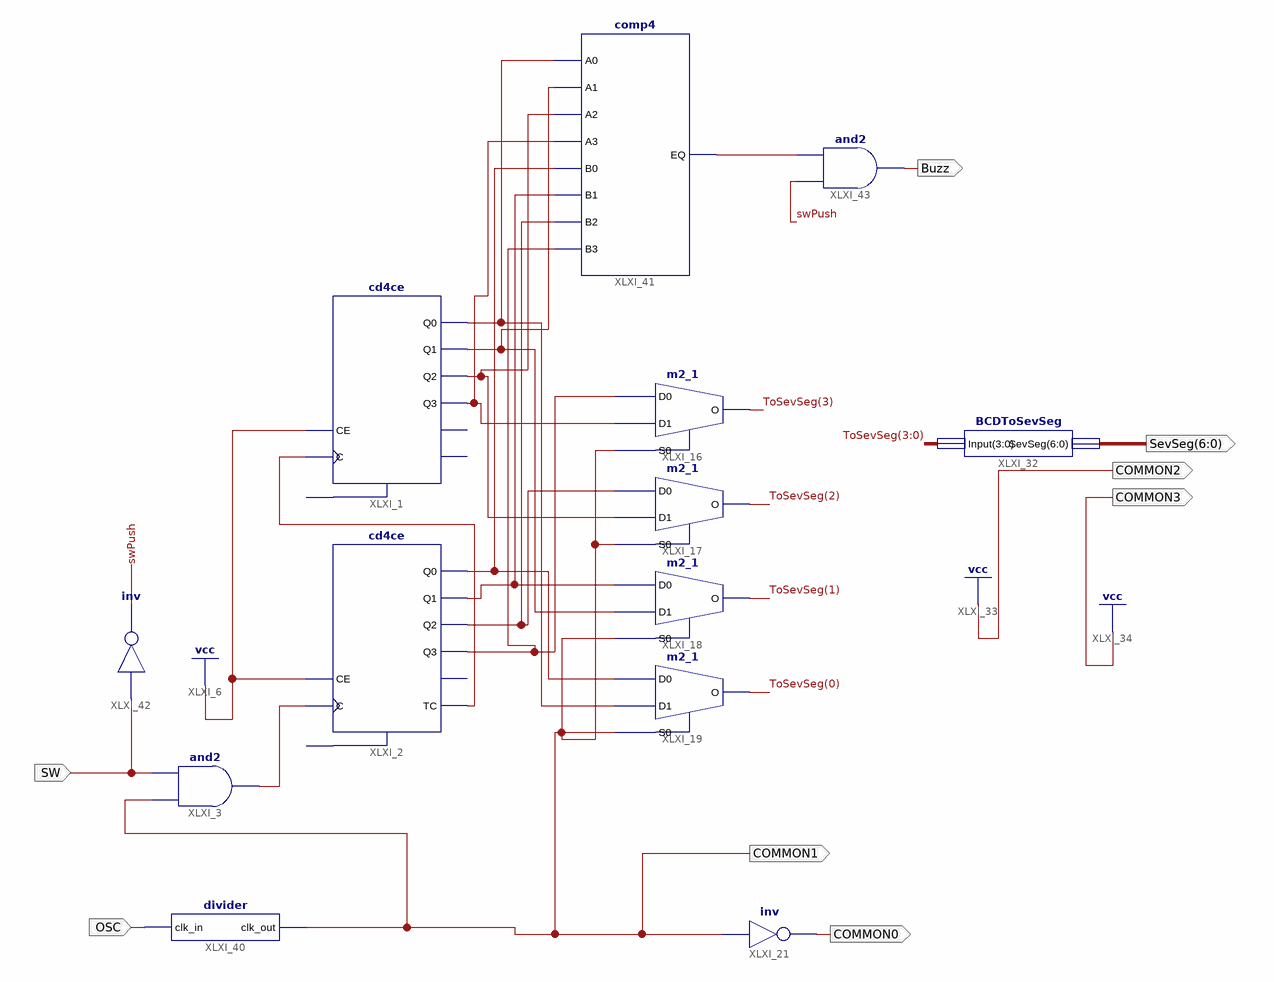
[diagram p0: schematic sheet 1]
// Xilinx ISE schematic CounterNaja.sch (spartan6) as structural Verilog: 13 symbols, 8 ports
module CounterNaja (
  input  SW,
  input  OSC,
  output COMMON0,
  output COMMON2,
  output COMMON3,
  output [6:0] SevSeg,
  output COMMON1,
  output Buzz
);

  wire Buzzer, L7, OutA_0, OutA_1, OutA_2, OutA_3, OutB_0, OutB_1, OutB_2, swPush, XLXN_16, XLXN_76;
  wire [3:0] ToSevSeg;

  cd4ce XLXI_1 (.C(XLXN_16), .CE(1'b1), .Q0(OutB_0), .Q1(OutB_1), .Q2(OutB_2), .Q3(L7));  // open: CLR, CEO, TC
  cd4ce XLXI_2 (
    .C(XLXN_76), .CE(1'b1), .Q0(OutA_0), .Q1(OutA_1), .Q2(OutA_2), .Q3(OutA_3), .TC(XLXN_16));  // open: CLR, CEO
  and XLXI_3 (XLXN_76, COMMON1, SW);
  m2_1 XLXI_16 (.D0(OutA_3), .D1(L7), .S0(COMMON1), .O(ToSevSeg[3]));
  m2_1 XLXI_17 (.D0(OutA_2), .D1(OutB_2), .S0(COMMON1), .O(ToSevSeg[2]));
  m2_1 XLXI_18 (.D0(OutA_1), .D1(OutB_1), .S0(COMMON1), .O(ToSevSeg[1]));
  m2_1 XLXI_19 (.D0(OutA_0), .D1(OutB_0), .S0(COMMON1), .O(ToSevSeg[0]));
  not XLXI_21 (COMMON0, COMMON1);
  BCDToSevSeg XLXI_32 (.Input(ToSevSeg), .SevSeg(SevSeg));
  divider XLXI_40 (.clk_in(OSC), .clk_out(COMMON1));
  comp4 XLXI_41 (
    .A0(OutB_0), .A1(OutB_1), .A2(OutB_2), .A3(L7), .B0(OutA_0), .B1(OutA_1), .B2(OutA_2), .B3(OutA_3),
    .EQ(Buzzer));
  not XLXI_42 (swPush, SW);
  and XLXI_43 (Buzz, swPush, Buzzer);

  assign COMMON2 = 1'b1;
  assign COMMON3 = 1'b1;
endmodule
